# EAGLE schematic usb-100basefx (EAGLE 6.3)
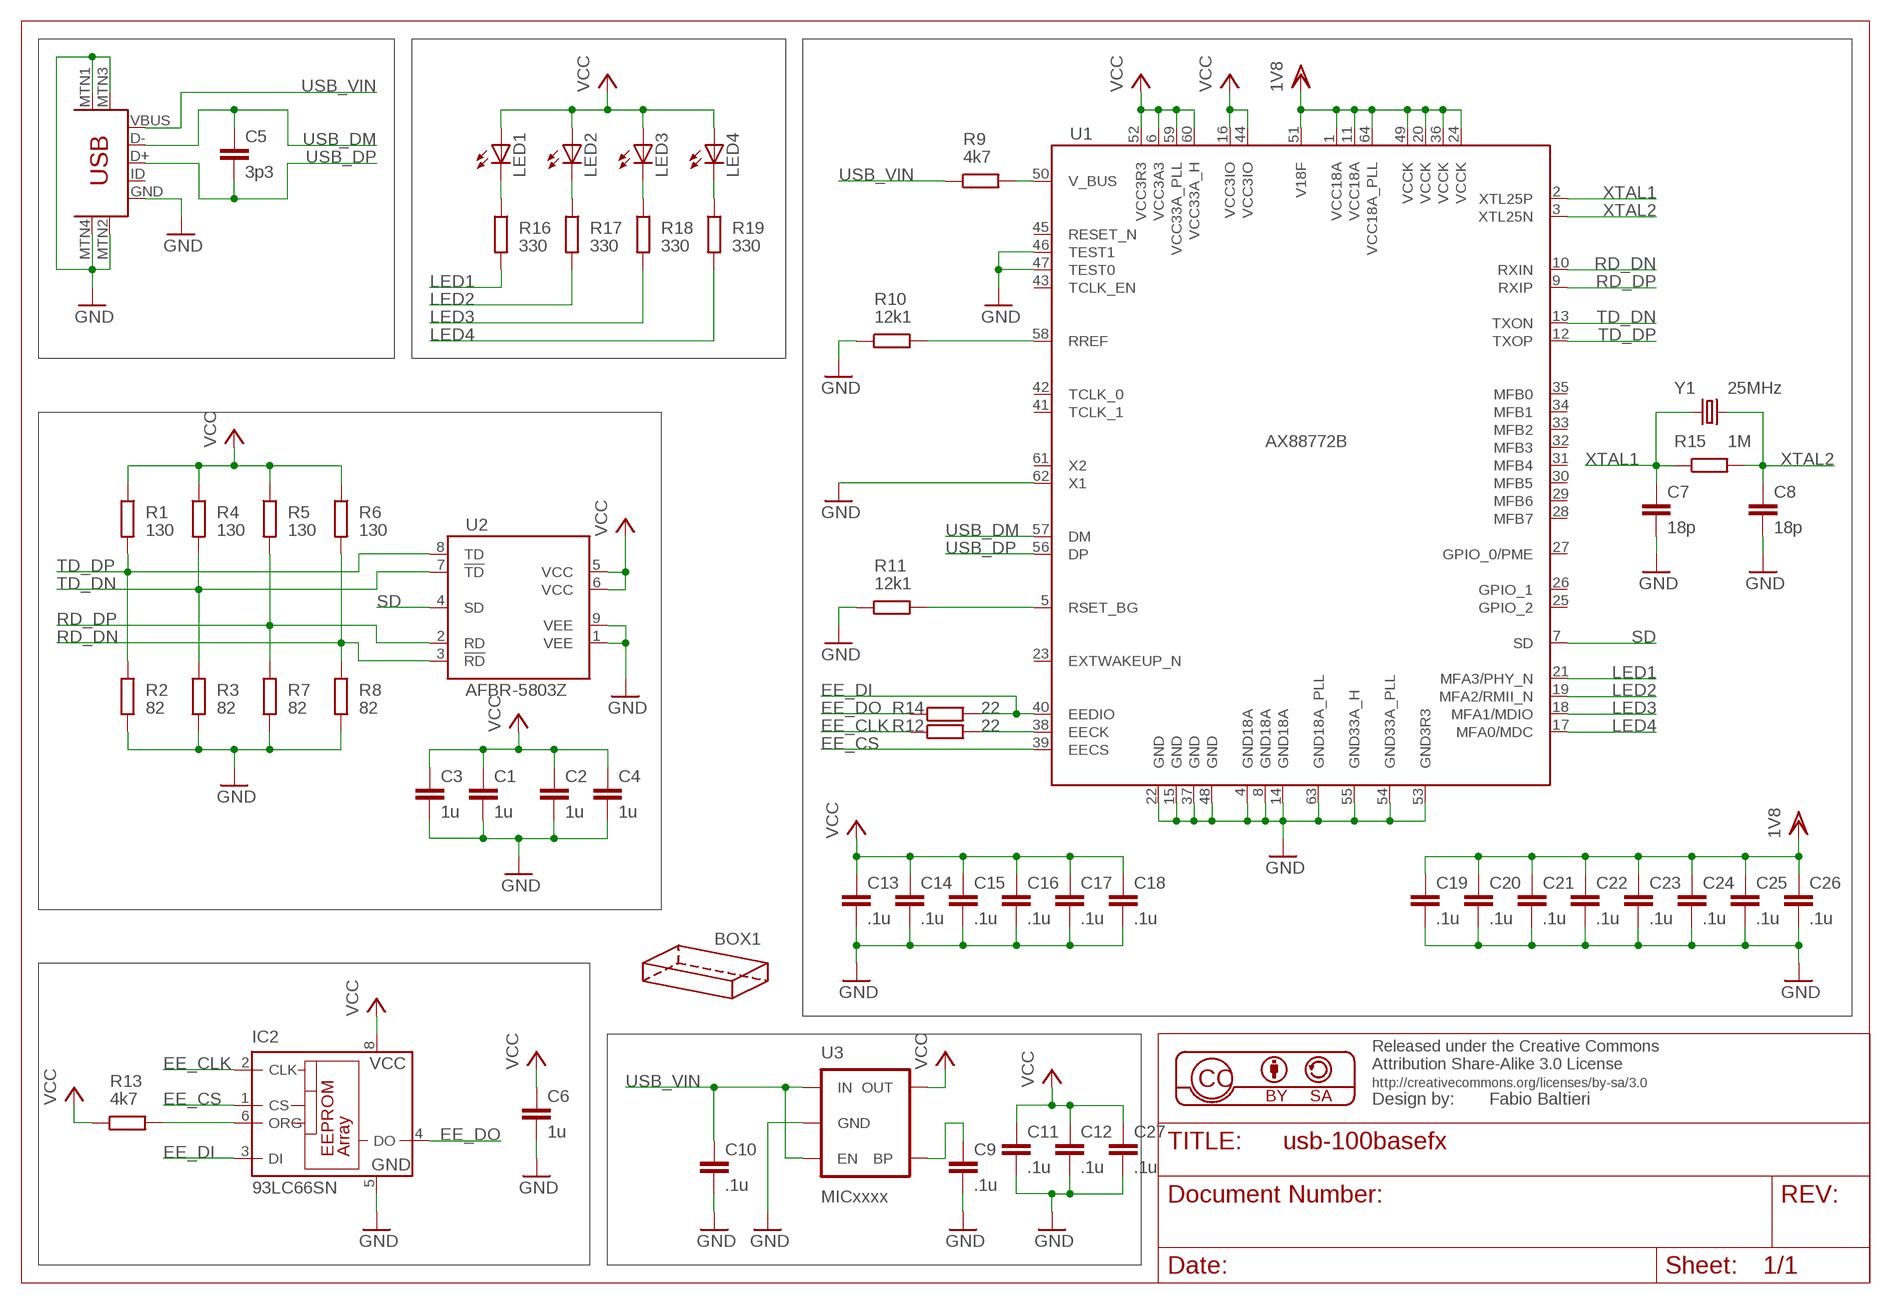
[diagram p0: schematic, sheet 1]

## Parts
BOX1  HAMMOND-BOX-R  [1551R]
C1  1u  C-EUC0603  [C0603]
C2  1u  C-EUC0603  [C0603]
C3  1u  C-EUC0603  [C0603]
C4  1u  C-EUC0603  [C0603]
C5  3p3  C-EUC0603  [C0603]
C6  1u  C-EUC0603  [C0603]
C7  18p  C-EUC0603  [C0603]
C8  18p  C-EUC0603  [C0603]
C9  .1u  C-EUC0603  [C0603]
C10  .1u  C-EUC0603  [C0603]
C11  .1u  C-EUC0603  [C0603]
C12  .1u  C-EUC0603  [C0603]
C13  .1u  C-EUC0603  [C0603]
C14  .1u  C-EUC0603  [C0603]
C15  .1u  C-EUC0603  [C0603]
C16  .1u  C-EUC0603  [C0603]
C17  .1u  C-EUC0603  [C0603]
C18  .1u  C-EUC0603  [C0603]
C19  .1u  C-EUC0603  [C0603]
C20  .1u  C-EUC0603  [C0603]
C21  .1u  C-EUC0603  [C0603]
C22  .1u  C-EUC0603  [C0603]
C23  .1u  C-EUC0603  [C0603]
C24  .1u  C-EUC0603  [C0603]
C25  .1u  C-EUC0603  [C0603]
C26  .1u  C-EUC0603  [C0603]
C27  .1u  C-EUC0603  [C0603]
IC2  93LC66SN  [SO-08]
LED1  LEDCHIPLED_0805  [CHIPLED_0805]
LED2  LEDCHIPLED_0805  [CHIPLED_0805]
LED3  LEDCHIPLED_0805  [CHIPLED_0805]
LED4  LEDCHIPLED_0805  [CHIPLED_0805]
R1  130  R-EU_R0603  [R0603]
R2  82  R-EU_R0603  [R0603]
R3  82  R-EU_R0603  [R0603]
R4  130  R-EU_R0603  [R0603]
R5  130  R-EU_R0603  [R0603]
R6  130  R-EU_R0603  [R0603]
R7  82  R-EU_R0603  [R0603]
R8  82  R-EU_R0603  [R0603]
R9  4k7  R-EU_R0603  [R0603]
R10  12k1  R-EU_R0603  [R0603]
R11  12k1  R-EU_R0603  [R0603]
R12  22  R-EU_R0603  [R0603]
R13  4k7  R-EU_R0603  [R0603]
R14  22  R-EU_R0603  [R0603]
R15  1M  R-EU_R0603  [R0603]
R16  330  R-EU_R0603  [R0603]
R17  330  R-EU_R0603  [R0603]
R18  330  R-EU_R0603  [R0603]
R19  330  R-EU_R0603  [R0603]
U1  AX88772B  [LQFP64]
U2  AFBR-5803Z  [AFBR-5803Z]
U3  MICxxxx  V_REG_LDOSMD  [SOT23-5]
U$1  USB-MINIB-5PIN  [USB-MINIB]
Y1  25MHz  CRYSTAL5X3  [CRYSTAL-SMD-5X3]

## Nets
EE_CLK: IC2.2(CLK) R12.1
EE_CS: IC2.1(CS) U1.39(EECS)
EE_DI: IC2.3(DI) R14.2 U1.40(EEDIO)
EE_DO: IC2.4(DO) R14.1
GND: C1.2 C2.2 C3.2 C4.2 C6.2 C7.2 C8.2 C9.2 C10.2 C11.2 C12.2 C13.2 C14.2 C15.2 C16.2 C17.2 C18.2 C19.2 C20.2 C21.2 C22.2 C23.2 C24.2 C25.2 C26.2 C27.2 IC2.5(GND) R2.2 R3.2 R7.2 R8.2 R10.1 R11.1 U1.4(GND18A) U1.8(GND18A) U1.14(GND18A) U1.15(GND) U1.22(GND) U1.37(GND) U1.46(TEST1) U1.47(TEST0) U1.48(GND) U1.53(GND3R3) U1.54(GND33A_PLL) U1.55(GND33A_H) U1.62(X1) U1.63(GND18A_PLL) U2.1(VEE) U2.9(VEE) U3.2(GND) U$1.GND U$1.MTN1(MTN2) U$1.MTN2(MTN3) U$1.MTN3(MTN1) U$1.MTN4
LED1: R16.2 U1.21(MFA3/PHY_N)
LED2: R17.2 U1.19(MFA2/RMII_N)
LED3: R18.2 U1.18(MFA1/MDIO)
LED4: R19.2 U1.17(MFA0/MDC)
N$1: R9.2 U1.50(V_BUS)
N$2: R10.2 U1.58(RREF)
N$3: R11.2 U1.5(RSET_BG)
N$4: R12.2 U1.38(EECK)
N$5: IC2.6(ORG) R13.2
N$6: C9.1 U3.4(BP)
N$7: LED1.C R16.1
N$8: LED2.C R17.1
N$9: LED3.C R18.1
N$10: LED4.C R19.1
RD_DN: R6.2 R8.1 U1.10(RXIN) U2.3(!RD)
RD_DP: R5.2 R7.1 U1.9(RXIP) U2.2(RD)
SD: U1.7(SD) U2.4(SD)
TD_DN: R3.1 R4.2 U1.13(TXON) U2.7(!TD)
TD_DP: R1.2 R2.1 U1.12(TXOP) U2.8(TD)
USB_DM: C5.1 U1.57(DM) U$1.D-
USB_DP: C5.2 U1.56(DP) U$1.D+
USB_VIN: C10.1 R9.1 U3.1(IN) U3.3(EN) U$1.VBUS
VCC: C1.1 C2.1 C3.1 C4.1 C6.1 C11.1 C12.1 C13.1 C14.1 C15.1 C16.1 C17.1 C18.1 C27.1 IC2.8(VCC) LED1.A LED2.A LED3.A LED4.A R1.1 R4.1 R5.1 R6.1 R13.1 U1.6(VCC3A3) U1.16(VCC3IO) U1.44(VCC3IO) U1.52(VCC3R3) U1.59(VCC33A_PLL) U1.60(VCC33A_H) U2.5(VCC) U2.6(VCC) U3.5(OUT)
VDD: C19.1 C20.1 C21.1 C22.1 C23.1 C24.1 C25.1 C26.1 U1.1(VCC18A) U1.11(VCC18A) U1.20(VCCK) U1.24(VCCK) U1.36(VCCK) U1.49(VCCK) U1.51(V18F) U1.64(VCC18A_PLL) ; supply symbol labelled 1V8
XTAL1: C7.1 R15.1 U1.2(XTL25P) Y1.1
XTAL2: C8.1 R15.2 U1.3(XTL25N) Y1.3
Unconnected: IC2.7(NU) U1.23(EXTWAKEUP_N) U1.25(GPIO_2) U1.26(GPIO_1) U1.27(GPIO_0/PME) U1.28(MFB7) U1.29(MFB6) U1.30(MFB5) U1.31(MFB4) U1.32(MFB3) U1.33(MFB2) U1.34(MFB1) U1.35(MFB0) U1.41(TCLK_1) U1.42(TCLK_0) U1.43(TCLK_EN) U1.45(RESET_N) U1.61(X2) U$1.ID

## Library data of the parts
BOX1 = hammond:HAMMOND-BOX: Hammond Project boxes Hammond 1551 Transluscent Blue 50x35x20mm 1551GTBU http://www.hammondmfg.com/pdf/1551G.pdf Hammond 1551 Transluscent Blue 50x50x20mm 1551RTBU http://www.hammondmfg.com/pdf/1551R.pdf Hammond 1551 Transluscent Blue 60x35x20mm 1551HTBU http://www.hammondmfg.com/pdf/1551H.pdf Hammond 1551 Transluscent Blue 80x40x20mm 1551KTBU http://www.hammondmfg.com/pdf/1551K.pdf Hammond 1591 Transluscent Blue 100x51x22m m 1591XXATBU http://www.hammondmfg.com/pdf/1591XXA.pdf
C1-C27 = rcl:C-EU: CAPACITOR, European symbol
IC2 = microchip:93*: Serial EPROM 1 K/2 K/4 K, low voltage, Microwire; MF: MICROCHIP; MPN: 93LC66/SN; OC_FARNELL: 1296586; OC_NEWARK: 65K1154
LED1-LED4 = led:LED: LED OSRAM: - CHIPLED LG R971, LG N971, LY N971, LG Q971, LY Q971, LO R971, LY R971 LH N974, LH R974 LS Q976, LO Q976, LY Q976 LO Q996 - Hyper CHIPLED LW Q18S LB Q993, LB Q99A, LB R99A - SideLED LS A670, LO A670, LY A670, LG A670, LP A670 LB A673, LV A673, LT A673, LW A673 LH A674 LY A675 LS A676, LA A676, LO A676, LY A676, LW A676 LS A679, LY A679, LG A679 - Hyper Micro SIDELED® LS Y876, LA Y876, LO Y876, LY Y876 LT Y87S - SmartLED LW L88C, LW L88S LB L89C, LB L89S, LG L890 LS L89K, LO L89K, LY L89K LS L896, LA L896, LO L896, LY L896 - TOPLED LS T670, LO T670, LY T670, LG T670, LP T670 LSG T670, LSP T670, LSY T670, LOP T670, LYG T670 LG T671, LOG T671, LSG T671 LB T673, LV T673, LT T673, LW T673 LH T674 LS T676, LA T676, LO T676, LY T676, LB T676, LH T676, LSB T676, LW T676 LB T67C, LV T67C, LT T67C, LS T67K, LO T67K, LY T67K, LW E67C LS E67B, LA E67B, LO E67B, LY E67B, LB E67C, LV E67C, LT E67C LW T67C LS T679, LY T679, LG T679 LS T770, LO T770, LY T770, LG T770, LP T770 LB T773, LV T773, LT T773, LW T773 LH T774 LS E675, LA E675, LY E675, LS T675 LS T776, LA T776, LO T776, LY T776, LB T776 LHGB T686 LT T68C, LB T68C - Hyper Mini TOPLED® LB M676 - Mini TOPLED Santana® LG M470 LS M47K, LO M47K, LY M47K Source: http://www.osram.convergy.de LUXEON: - LUMILED® LXK2-PW12-R00, LXK2-PW12-S00, LXK2-PW14-U00, LXK2-PW14-V00 LXK2-PM12-R00, LXK2-PM12-S00, LXK2-PM14-U00 LXK2-PE12-Q00, LXK2-PE12-R00, LXK2-PE12-S00, LXK2-PE14-T00, LXK2-PE14-U00 LXK2-PB12-K00, LXK2-PB12-L00, LXK2-PB12-M00, LXK2-PB14-N00, LXK2-PB14-P00, LXK2-PB14-Q00 LXK2-PR12-L00, LXK2-PR12-M00, LXK2-PR14-Q00, LXK2-PR14-R00 LXK2-PD12-Q00, LXK2-PD12-R00, LXK2-PD12-S00 LXK2-PH12-R00, LXK2-PH12-S00 LXK2-PL12-P00, LXK2-PL12-Q00, LXK2-PL12-R00 Source: www.luxeon.com KINGBRIGHT: KA-3528ASYC Source: www.kingbright.com
R1-R19 = rcl:R-EU_: RESISTOR, European symbol
U1 = balto:AX88772B: AX88772BLF / AX88772BLI Low-power
U2 = balto:AFBR-5803Z: AFBR-5803Z
U3 = SparkFun-PowerIC:V_REG_LDO: Voltage Regulator LDO Standard 150mA LDO voltage regulator in SOT-23 layout. Micrel part MIC5205. BP (by-pass) pin is used to lower output noise with 470pF cap.
U$1 = SparkFun-Connectors:USB-MINIB: Mini-USB "B" connector with 5th pin broken out. Created new symbol breaking out 5th "ID" pin in mini/micro USB connector spec. See: http://en.wikipedia.org/wiki/Mini_usb#Cables. Uses same footprint as 4-pin symbol. Also added pins to connect to mounting / shield pads if required (probably not generally needed as signals aren't shielded once they leave the connector).
Y1 = SparkFun-FreqCtrl:CRYSTAL: Various standard crystals. Proven footprints. Spark Fun Electronics SKU : COM-00534